# EAGLE design Astable_555_timer (EAGLE 9.6.2)
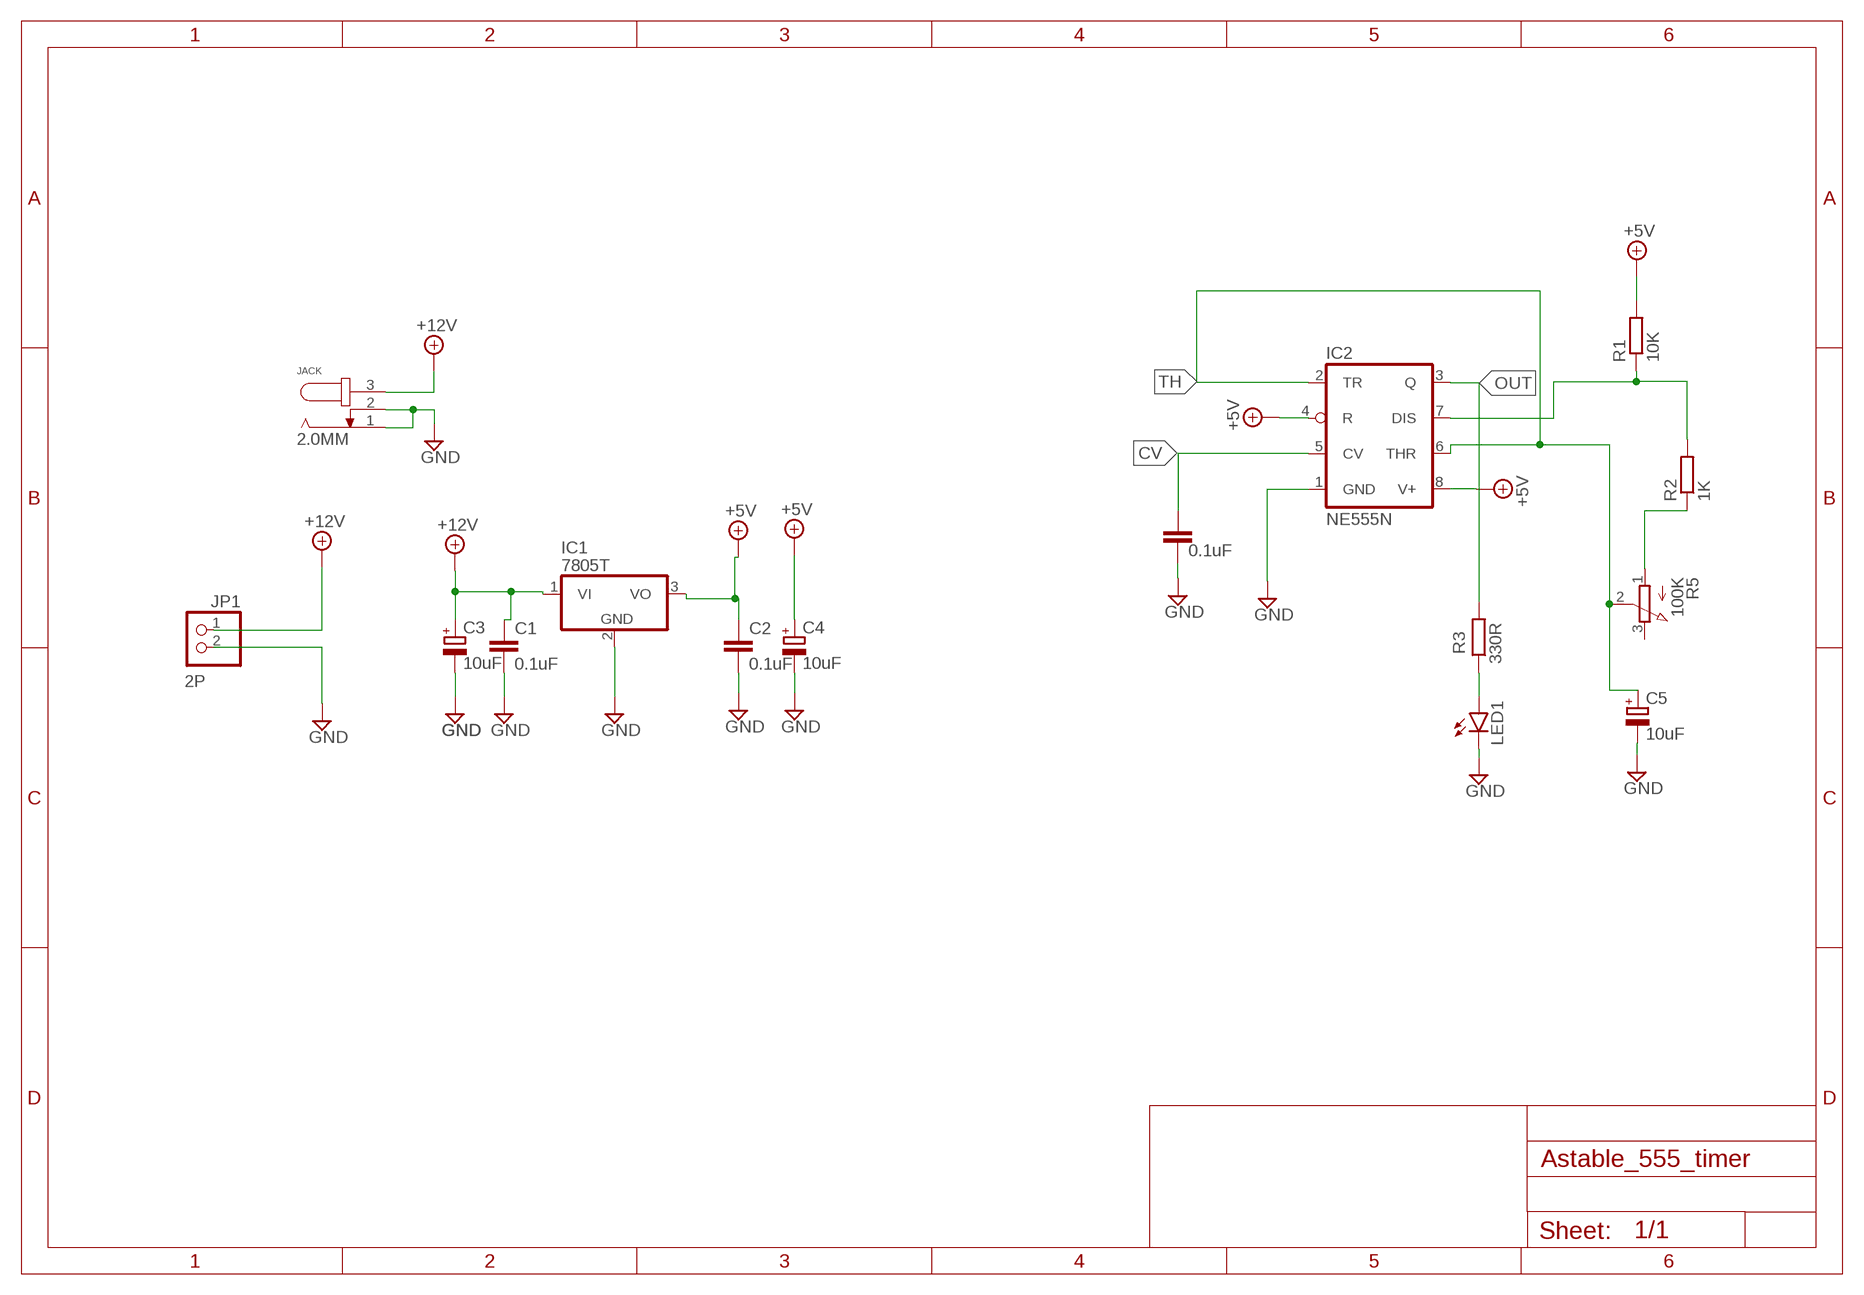
[diagram p0: schematic, sheet 1]

## Parts
C1  0.1uF  C-EU050-030X075  [C050-030X075]
C2  0.1uF  C-EU050-030X075  [C050-030X075]
C3  10uF  CPOL-EUE3.5-8  [E3,5-8]
C4  10uF  CPOL-EUE3.5-8  [E3,5-8]
C5  10uF  CPOL-EUE3.5-8  [E3,5-8]
C6  0.1uF  C-EU050-030X075  [C050-030X075]
IC1  7805T  [TO220H]
IC2  NE555N  [DIL08]
JACK  2.0MM  JACK-PLUG1  [SPC4078]
JP1  2P  PINHD-1X2  [1X02]
LED1  LED5MM  [LED5MM]
R1  10K  R-EU_0207/10  [0207/10]
R2  1K  R-EU_0207/10  [0207/10]
R3  330R  R-EU_0207/10  [0207/10]
R5  100K  3RP/1610N  [3RP/1610N]

## Nets
+5V [POWER]: C2.1 C4.+ IC1.3(VO) IC2.4(R) IC2.8(V+) R1.2
+12V [POWER]: C1.1 C3.+ IC1.1(VI) JACK.3 JP1.1
CV: C6.1 IC2.5(CV)
GND [POWER]: C1.2 C2.2 C3.- C4.- C5.- C6.2 IC1.2(GND) IC2.1(GND) JACK.1 JACK.2 JP1.2 LED1.K(C)
N$3: R2.1 R5.1(A)
N$4: IC2.7(DIS) R1.1 R2.2
N$9: LED1.A R3.1
OUT: IC2.3(Q) R3.2
TH: C5.+ IC2.2(TR) IC2.6(THR) R5.2(S)
Unconnected: R5.3(E)

## Library data of the parts
C1 C2 C6 = rcl:C-EU: CAPACITOR, European symbol; SPICEPREFIX: C
C3-C5 = rcl:CPOL-EU: POLARIZED CAPACITOR, European symbol; SPICEPREFIX: C
IC1 = linear:78*: Positive VOLTAGE REGULATOR Source: http://cache.national.com/ds/LM/LM78L05.pdf http://www.fairchildsemi.com/ds/LM/LM7805.pdf
IC2 = linear:*555: TIMER
JACK = con-jack:JACK-PLUG: DC POWER JACK Power Jack, DC, Right Angle, Through Hole, Rated 5A at 16VDC, PC Terminals Distributor: Farnell (www.Farnell.de) Drawing: 84N1161.pdf / 84N1162.pdf Manufacturer: SPC Technology (www.spctechnology.com) Type: SPC4077 / SPC 4078; OC_FARNELL: unknown; OC_NEWARK: unknown
JP1 = pinhead:PINHD-1X2: PIN HEADER
LED1 = led:LED: LED OSRAM: - CHIPLED LG R971, LG N971, LY N971, LG Q971, LY Q971, LO R971, LY R971 LH N974, LH R974 LS Q976, LO Q976, LY Q976 LO Q996 - Hyper CHIPLED LW Q18S LB Q993, LB Q99A, LB R99A - SideLED LS A670, LO A670, LY A670, LG A670, LP A670 LB A673, LV A673, LT A673, LW A673 LH A674 LY A675 LS A676, LA A676, LO A676, LY A676, LW A676 LS A679, LY A679, LG A679 - Hyper Micro SIDELED® LS Y876, LA Y876, LO Y876, LY Y876 LT Y87S - SmartLED LW L88C, LW L88S LB L89C, LB L89S, LG L890 LS L89K, LO L89K, LY L89K LS L896, LA L896, LO L896, LY L896 - TOPLED LS T670, LO T670, LY T670, LG T670, LP T670 LSG T670, LSP T670, LSY T670, LOP T670, LYG T670 LG T671, LOG T671, LSG T671 LB T673, LV T673, LT T673, LW T673 LH T674 LS T676, LA T676, LO T676, LY T676, LB T676, LH T676, LSB T676, LW T676 LB T67C, LV T67C, LT T67C, LS T67K, LO T67K, LY T67K, LW E67C LS E67B, LA E67B, LO E67B, LY E67B, LB E67C, LV E67C, LT E67C LW T67C LS T679, LY T679, LG T679 LS T770, LO T770, LY T770, LG T770, LP T770 LB T773, LV T773, LT T773, LW T773 LH T774 LS E675, LA E675, LY E675, LS T675 LS T776, LA T776, LO T776, LY T776, LB T776 LHGB T686 LT T68C, LB T68C - Hyper Mini TOPLED® LB M676 - Mini TOPLED Santana® LG M470 LS M47K, LO M47K, LY M47K Source: http://www.osram.convergy.de LUXEON: - LUMILED® LXK2-PW12-R00, LXK2-PW12-S00, LXK2-PW14-U00, LXK2-PW14-V00 LXK2-PM12-R00, LXK2-PM12-S00, LXK2-PM14-U00 LXK2-PE12-Q00, LXK2-PE12-R00, LXK2-PE12-S00, LXK2-PE14-T00, LXK2-PE14-U00 LXK2-PB12-K00, LXK2-PB12-L00, LXK2-PB12-M00, LXK2-PB14-N00, LXK2-PB14-P00, LXK2-PB14-Q00 LXK2-PR12-L00, LXK2-PR12-M00, LXK2-PR14-Q00, LXK2-PR14-R00 LXK2-PD12-Q00, LXK2-PD12-R00, LXK2-PD12-S00 LXK2-PH12-R00, LXK2-PH12-S00 LXK2-PL12-P00, LXK2-PL12-Q00, LXK2-PL12-R00 Source: www.luxeon.com KINGBRIGHT: KA-3528ASYC Source: www.kingbright.com
R1-R3 = rcl:R-EU_: RESISTOR, European symbol; SPICEPREFIX: R
R5 = pot:3RP/1610N: 16mm Potentiometer one level Source: http://www.alphapotentiometers.net/html/16mm_pot_2.html

## Net classes
0 default: width 0.305 mm, drill 0.305 mm, clearance 0.254 mm
1 POWER: width 0.406 mm, drill 0.406 mm, clearance 0.305 mm

## Board
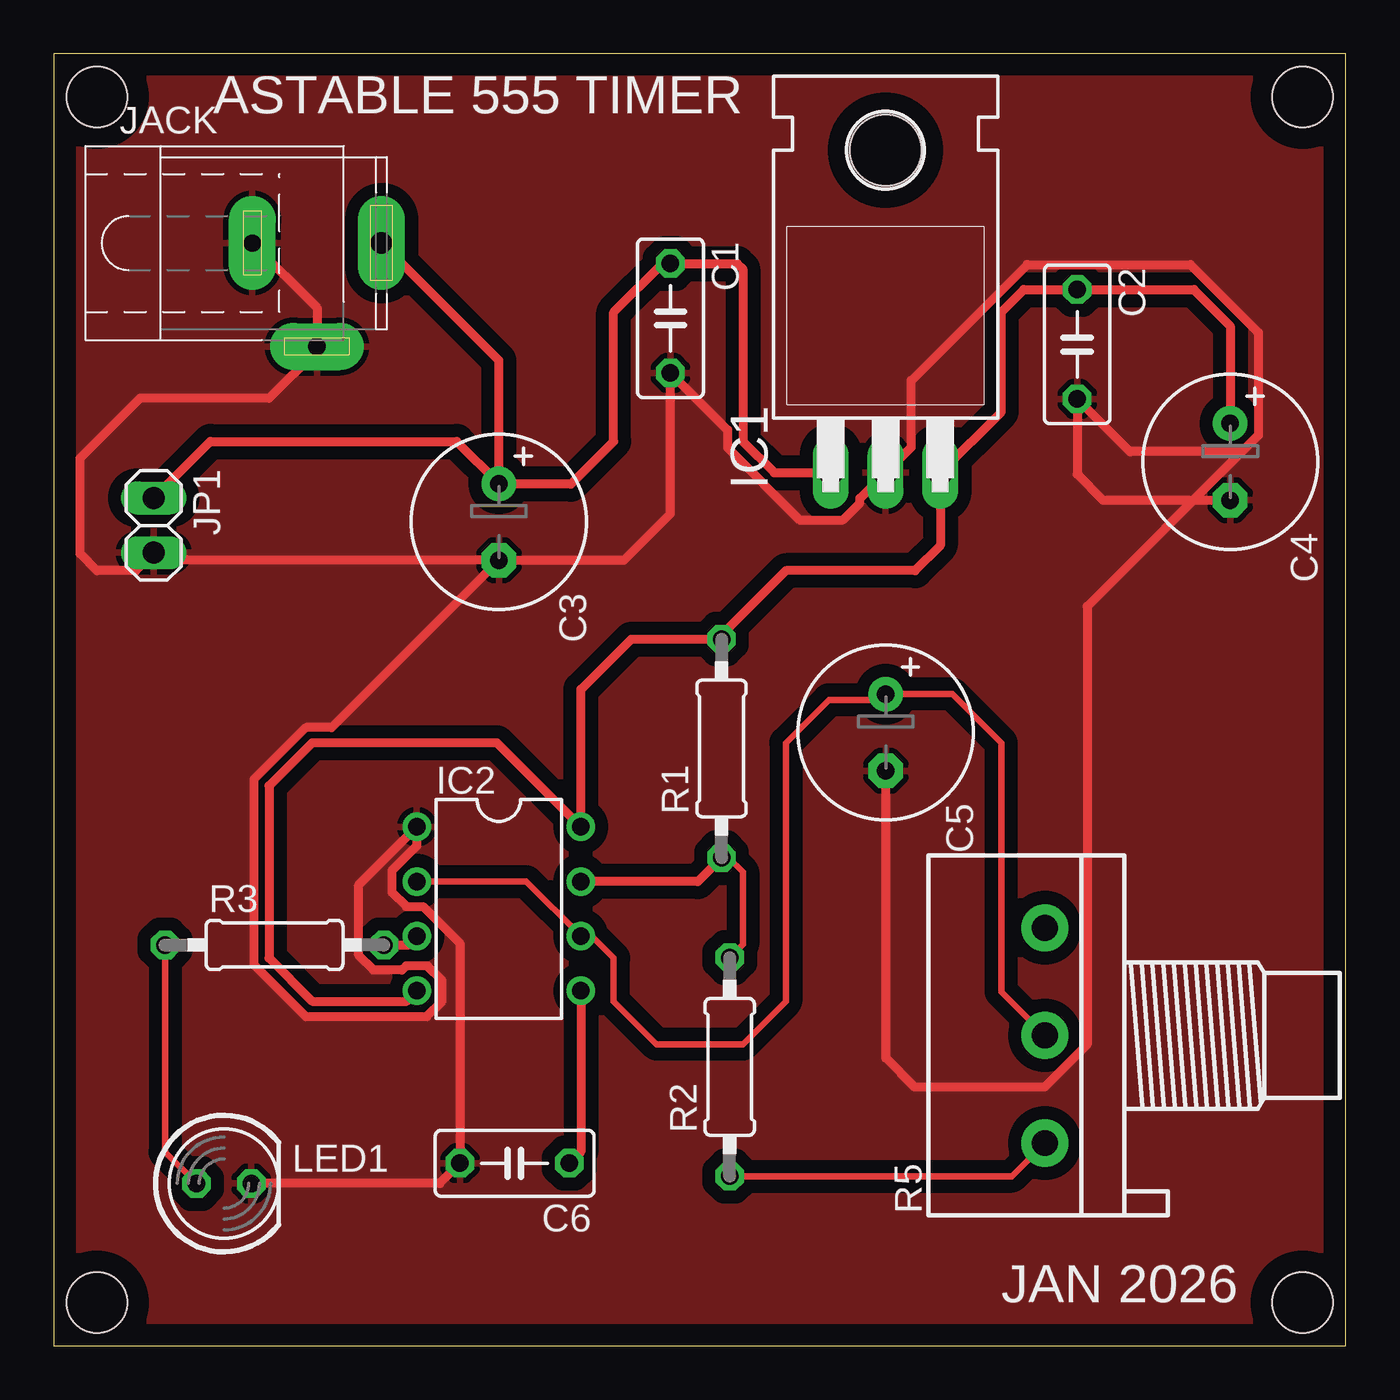
[diagram p1: board, top side]

Size 60 x 60 mm. Coordinates in mm from the lower left corner, seen from the top.
Outline: 0,0 60,0 60,60 0,60 0,0
Copper layers (1*16): Top 0.035mm / dielectric 1.5mm / Bottom 0.035mm
Design rules "default": minimum track width 6mil, minimum drill 0.35mm, track to track 6mil, track to pad 6mil, pad to pad 6mil, via to via 6mil, smd to smd 6mil, copper to edge 40mil, drill to drill 6mil, minimum pad ring 10mil, minimum via ring 8mil, stop-mask expansion 4mil, vias tented up to drill 0mil, thermal gap 10mil
Holes 2.8 mm at 58,58 2,58 2,2 58,2

### Footprints (pad centres in the part's own frame; a part is rotated, then mirrored left to right if it is on the bottom)
C050-030X075 = drill 0.813 octagon: 1 -2.54,0; 2 2.54,0
E3,5-8 = drill 0.813 pad 1.6: + -1.778,0 | drill 0.813 pad 1.6 octagon: - 1.778,0
TO220H = drill 1.118 long: 1 -2.54,-10.16; 2 0,-10.16; 3 2.54,-10.16 | hole 3.302: 0,4.826
DIL08 = drill 0.813 pad 1.27: 1 -3.81,-3.81; 2 -1.27,-3.81; 3 1.27,-3.81; 4 3.81,-3.81; 5 3.81,3.81; 6 1.27,3.81; 7 -1.27,3.81; 8 -3.81,3.81
SPC4078 = drill 0.8 pad 2.184 long: 1 -3,0; 2 0,-4.8 | drill 1 pad 2.184 long: 3 3,0
1X02 = drill 1.016 long: 1 -1.27,0; 2 1.27,0
LED5MM = drill 0.813 octagon: A -1.27,0; K 1.27,0
0207/10 = drill 0.813 octagon: 1 -5.08,0; 2 5.08,0
3RP/1610N = drill 1.2 pad 2.184: 1 -5,0; 2 0,0; 3 5,0

### Placement (x,y rotation side)
C1  28.64,47.72 270 top
C2  47.53,46.51 270 top
C3  20.67,38.26 270 top
C4  54.64,41.05 270 top
C5  38.64,28.48 270 top
C6  21.4,8.47 180 top
IC1  38.63,50.7 0 top
IC2  20.67,20.29 270 top
JACK  12.22,51.21 0 top
JP1  4.64,38.1 270 top
LED1  7.9,7.53 0 top
R1  31.01,27.74 90 top
R2  31.39,12.95 90 top
R3  10.25,18.61 0 top
R5  46.03,14.41 90 top

### Tracks (layer width: path | path; a pad name or v marks a point on that pad's centre or on a via)
+5V
  Top 0.406: C4.+ 54.64,47.36 52.95,49.05 C2.1 45.05,49.05 44,48 44,43.37 IC1.3 41.17,37.17 40,36 34,36 31.01,33.01 R1.2 26.82,32.82 24.48,30.48 IC2.8 20.58,28 12,28 10,26 10,18 12,16 16.38,16 IC2.4
+12V
  Top 0.406: JACK.3 20.67,45.76 C3.+ | JP1.1 7.27,42 18.71,42 C3.+ | IC1.1 33.46,40.54 32,42 32,50 31.74,50.26 C1.1 28.26,50.26 26,48 26,42 24,40 23.96,40.04 C3.+
CV
  Top 0.406: IC2.5 24.48,9.01 C6.1
GND
  Top 0.406: C3.- 12.9,28.71 11.71,28.71 9.29,26.3 9.29,17.7 11.71,15.29 17.32,15.29 18.03,16 18.03,16.96 17.34,17.65 16.38,17.65 16.17,17.44 14.85,17.44 14.16,18.13 14.16,21.4 IC2.1 16.86,23.21 15.69,22.04 15.69,21.08 16.38,20.39 17.14,20.39 18.86,18.67 C6.2 17.92,7.53 LED1.K | C3.- 26.48,36.48 28.64,38.64 C1.2 31.29,42.53 31.29,41.7 34.64,38.36 36.65,38.36 37.44,39.14 37.44,39.35 IC1.2 39.82,41.73 39.82,44.83 45.21,50.22 52.79,50.22 55.95,47.06 55.95,42.29 55.18,41.52 | 55.18,41.52 49.98,41.52 C2.2 47.53,40.47 48.73,39.27 C4.- | 55.18,41.52 48,34.34 48,14 46,12 40,12 38.64,13.36 C5.- | C3.- 4.99,36.48 JP1.2 3.81,36 2,36 1.22,36.78 1.22,41.22 4,44 10,44 12.22,46.22 JACK.2 12.22,48.21 JACK.1
  pour Top (isolate 0.61): 0,60 60,60 60,0 0,0
N$3
  Top 0.305: R2.1 44.49,7.87 R5.1
N$4
  Top 0.305: R1.1 31.34,22.66 32,22 32,18.64 R2.2
  Top 0.406: R1.1 29.91,21.56 IC2.7
N$9
  Top 0.305: R3.1 5.17,8.99 LED1.A
OUT
  Top 0.406: R3.2 16.45,18.61 IC2.3
TH
  Top 0.305: R5.2 44,16.44 44,28 41.74,30.26 C5.+ 38.38,30 36,30 34,28 34,16 32,14 28,14 26,16 26,18 24.98,19.02 IC2.6 21.94,21.56 IC2.2

### Text on the board
tNames: ASTABLE 555 TIMER | JAN 2026